# Altium schematic sheet ATK_BC28_01.SchDoc
size A4
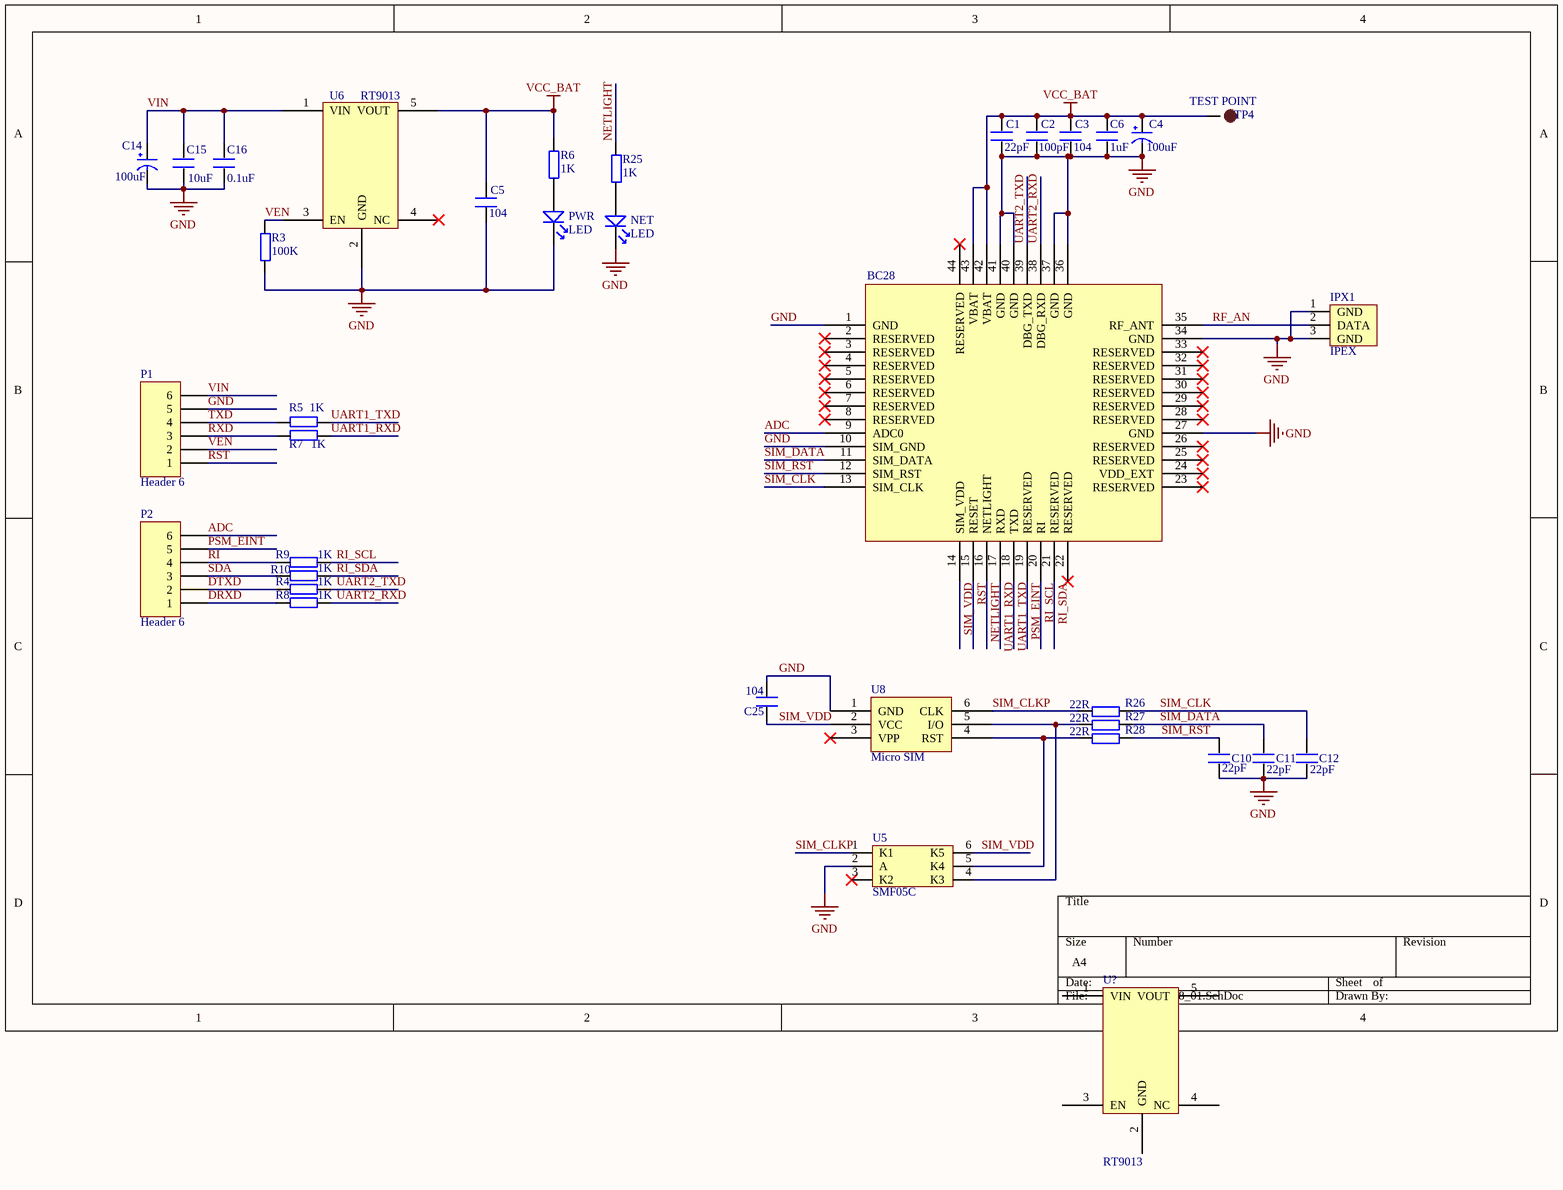
[diagram p0: ATK_BC28_01.SchDoc]

## Parts
?  BC28  [MG2260]
C1  22pF  [0402]
C2  100pF  [0402]
C3  104  [0603P]
C4  100uF  [CAP3528]
C5  104  [0603P]
C6  1uF  [0603P]
C10  22pF  [0402]
C11  22pF  [0402]
C12  22pF  [0402]
C14  100uF  [CAP3528]
C15  10uF  [0603P]
C16  0.1uF  [0603P]
C25  104  [0603P]
IPX1  IPEX  [IPEX]
NET  LED  [SMDLED]
P1  Header 6  [HDR1X6]
P2  Header 6  [HDR1X6]
PWR  LED  [SMDLED]
R3  100K  [0603P]
R4  1K  [0402]
R5  1K  [0402]
R6  1K  [0402]
R7  1K  [0402]
R8  1K  [0402]
R9  1K  [0402]
R10  1K  [0402]
R25  1K  [0402]
R26  22R  [0402]
R27  22R  [0402]
R28  22R  [0402]
TP4  TEST POINT  [TP-1.5]
U5  SMF05C  [SMF05C]
U6  RT9013  [SOT-23-5]
U8  Micro SIM  [Micro SIM]
U?  RT9013  [SOT-23-5]

## Nets
GND: ?.1(GND) ?.10(SIM_GND) ?.27(GND) ?.34(GND) ?.36(GND) ?.37(GND) ?.40(GND) ?.41(GND) C1.1 C2.1 C3.1 C4.2(GND) C5.1 C6.1 C10.2 C11.1 C12.1 C14.2(GND) C15.2 C16.1 C25.2 IPX1.1(GND) IPX1.3(GND) NET.2 P1.5 PWR.2 R3.1 U5.2(A) U6.2(GND) U8.1(GND)
VCC_BAT: ?.42(VBAT) ?.43(VBAT) C1.2 C2.2 C3.2 C4.1(VCC) C5.2 C6.2 R6.2 TP4.1 U6.5(VOUT)
ADC: ?.9(ADC0) P2.6
DRXD: P2.1 R8.2
DTXD: P2.2 R4.2
NETLIGHT: ?.16(NETLIGHT) R25.2
PSM_EINT: ?.19(RESERVED) P2.5
RF_AN: ?.35(RF_ANT) IPX1.2(DATA)
RI: P2.4 R9.2
RI_SCL: ?.20(RI) R9.1
RI_SDA: ?.21(RESERVED) R10.1
RST: ?.15(RESET) P1.1
RXD: P1.3 R7.2
SDA: P2.3 R10.2
SIM_CLK: ?.13(SIM_CLK) C12.2 R26.2
SIM_CLKP: R26.1 U5.1(K1) U8.6(CLK)
SIM_DATA: ?.11(SIM_DATA) C11.2 R27.2
SIM_RST: ?.12(SIM_RST) C10.1 R28.2
SIM_VDD: ?.14(SIM_VDD) C25.1 U5.6(K5) U8.2(VCC)
TXD: P1.4 R5.2
UART1_RXD: ?.17(RXD) R7.1
UART1_TXD: ?.18(TXD) R5.1
UART2_RXD: ?.38(DBG_RXD) R8.1
UART2_TXD: ?.39(DBG_TXD) R4.1
VEN: P1.2 R3.2 U6.3(EN)
VIN: C14.1(VCC) C15.1 C16.2 P1.6 U6.1(VIN)
NetNET_1: NET.1 R25.1
NetPWR_1: PWR.1 R6.1
NetR27_1: R27.1 U5.4(K3) U8.5(I/O)
NetR28_1: R28.1 U5.5(K4) U8.4(RST)

Not connected (* = marked no-connect by the designer): ? 2(RESERVED)* 3(RESERVED)* 4(RESERVED)* 5(RESERVED)* 6(RESERVED)* 7(RESERVED)* 8(RESERVED)* 22(RESERVED)* 23(RESERVED)* 24(VDD_EXT)* 25(RESERVED)* 26(RESERVED)* 28(RESERVED)* 29(RESERVED)* 30(RESERVED)* 31(RESERVED)* 32(RESERVED)* 33(RESERVED)* 44(RESERVED)*; U5 3(K2)*; U6 4(NC)*; U8 3(VPP)*; U? 1(VIN) 2(GND) 3(EN) 4(NC) 5(VOUT)

## Library data of the parts
? = MG2260
C1-C3 C5 C6 C10-C12 C15 C16 C25 = C
C4 C14 = CAP
IPX1 = IPEX: IPEX座
P1 P2 = Header 6: Header, 6-Pin; LatestRevisionDate: 17-Jul-2002; LatestRevisionNote: Re-released for DXP Platform.; Publisher: Altium Limited
R3-R10 R25-R28 = R
TP4 = TEST-POINT: 测试点
U5 = SMF05C: TVS